# EAGLE design 2PCB-Part1 (EAGLE 9.6.2)
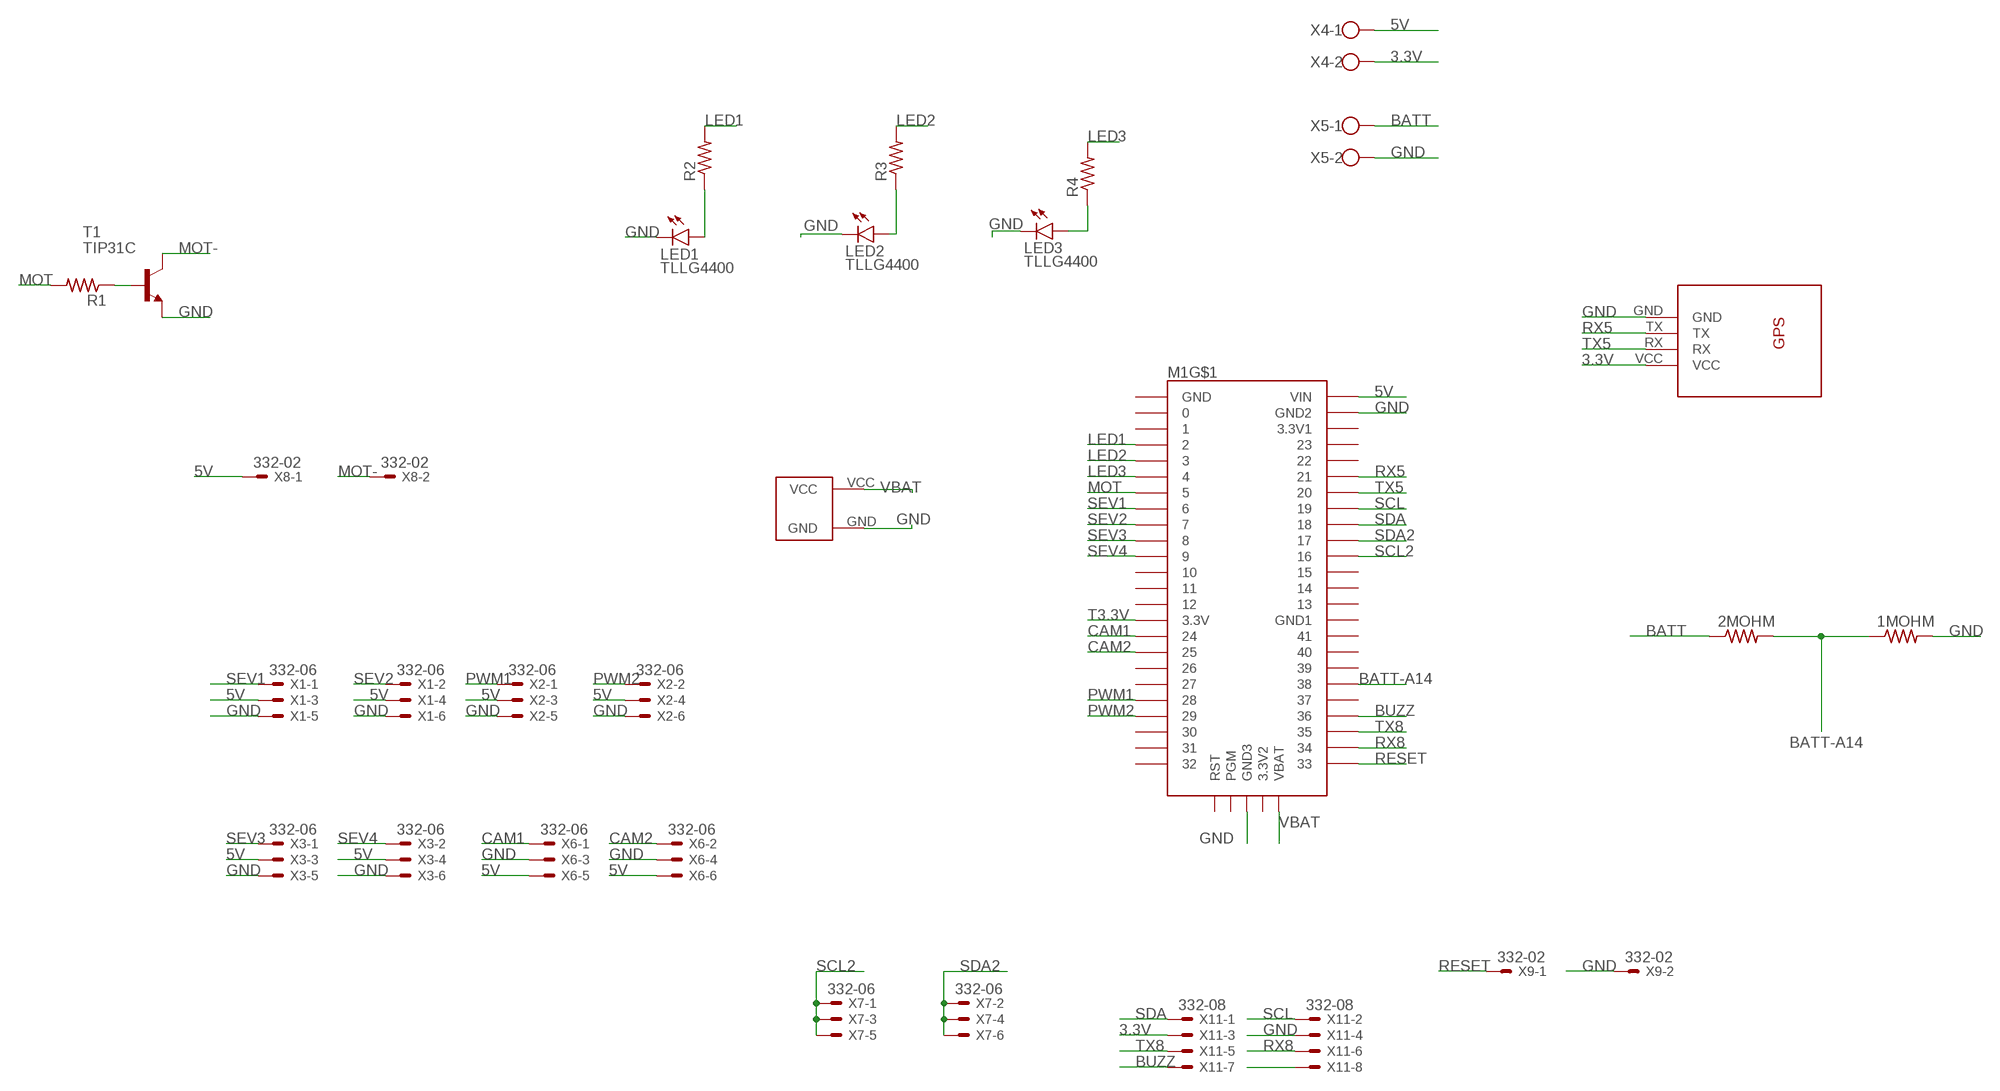
[diagram p0: schematic, sheet 1]

## Parts
1MOHM  R-US_0207/10  [0207/10]
2MOHM  R-US_0207/10  [0207/10]
LED1  TLLG4400  [LED3MM]
LED2  TLLG4400  [LED3MM]
LED3  TLLG4400  [LED3MM]
M1  TEENSY4.1  [TEENSY4.1]
R1  R-US_0207/10  [0207/10]
R2  R-US_0207/10  [0207/10]
R3  R-US_0207/10  [0207/10]
R4  R-US_0207/10  [0207/10]
T1  TIP31C  [TO220]
U$1  GPS  [GPS]
U$2  CR2032  [CR2032-20MM]
X1  332-06  [332-06]
X2  332-06  [332-06]
X3  332-06  [332-06]
X4  W237-102  [W237-102]
X5  W237-102  [W237-102]
X6  332-06  [332-06]
X7  332-06  [332-06]
X8  332-02  [332-02]
X9  332-02  [332-02]
X11  332-08  [332-08]

## Nets
3.3V: U$1.VCC X4.2 X11.3
5V: M1.VIN X1.3 X1.4 X2.3 X2.4 X3.3 X3.4 X4.1 X6.5 X6.6 X8.1
BATT: 2MOHM.1 X5.1
BATT-A14: 1MOHM.1 2MOHM.2 M1.38
BUZZ: M1.36 X11.7
CAM1: M1.24 X6.1
CAM2: M1.25 X6.2
GND: 1MOHM.2 LED1.K(C) LED2.K(C) LED3.K(C) M1.AGND(GND2) M1.GND2(GND3) T1.3(E) U$1.GND U$2.GND X1.5 X1.6 X2.5 X2.6 X3.5 X3.6 X5.2 X6.3 X6.4 X9.2 X11.4
LED1: M1.2 R2.2
LED2: M1.3 R3.2
LED3: M1.4 R4.2
MOT: M1.5 R1.2
MOT-: T1.2(C) X8.2
N$1: LED1.A R2.1
N$2: LED2.A R3.1
N$3: LED3.A R4.1
N$4: R1.1 T1.1(B)
N$10: X11.8
PWM1: M1.28 X2.1
PWM2: M1.29 X2.2
RESET: M1.33 X9.1
RX5: M1.21/A7 U$1.TX
RX8: M1.34 X11.6
SCL: M1.19/A5/SCL X11.2
SCL2: M1.16/A2 X7.1 X7.3 X7.5
SDA: M1.18/A4/SDA X11.1
SDA2: M1.17/A3 X7.2 X7.4 X7.6
SEV1: M1.6 X1.1
SEV2: M1.7 X1.2
SEV3: M1.8 X3.1
SEV4: M1.9 X3.2
T3.3V: M1.3V3(3.3V)
TX5: M1.20/A6 U$1.RX
TX8: M1.35 X11.5
VBAT: M1.VBAT U$2.VCC
Unconnected: M1.0/RX M1.1/TX M1.3V3_LO(3.3V1) M1.10/CS M1.11/MOSI M1.12/MISO M1.13/SCK M1.14/A0 M1.15/A1 M1.22/A8 M1.23/A9 M1.26 M1.27 M1.30 M1.31/A12 M1.32 M1.37 M1.39 M1.40 M1.41 M1.ELED M1.ER+ M1.ER- M1.ET+(ET-) M1.ET-(ET+) M1.GND M1.GND1 M1.GND-E(EGND) M1.GND-U1(UGND1) M1.GND-U2(UGND2) M1.PROG(PGM) M1.RST M1.UD+(UDP) M1.UD-(UDM) M1.UVHST(U5V) M1.V33(3.3V2)

## Library data of the parts
1MOHM 2MOHM R1-R4 = rcl:R-US_: RESISTOR, American symbol; SPICEPREFIX: R
LED1-LED3 = led:TLLG4400: Low Current (2mA) LED 3 mm Tinted Diffused Package color GREEN Source: Data sheet <http://www.farnell.com/datasheets/391098.pdf>; MF: VISHAY SEMICONDUCTOR; OC_FARNELL: 1612435
M1 = teensy4.1.dist:TEENSY4.1
T1 = transistor:TIP31: NPN Transistor Medium Power Linear Switching Applications Source: http://onsemi.com
U$1 = GPS:GPS
U$2 = cr2032:CR2032
X1-X3 X6 X7 = 6pinConnector:332-06: 6 Pin - 2mm Dual Row Source: www.mpe-connector.de / garry_shortform_2012.pdf
X4 X5 = con-wago-500:W237-102: WAGO SCREW CLAMP; MPN: 237-102; OC_FARNELL: unknown; OC_NEWARK: 70K9898
X8 X9 = 6pinConnector:332-02: 2 Pin - 2mm Dual Row Source: www.mpe-connector.de / garry_shortform_2012.pdf
X11 = 6pinConnector:332-08: 8 Pin - 2mm Dual Row Source: www.mpe-connector.de / garry_shortform_2012.pdf

## Board
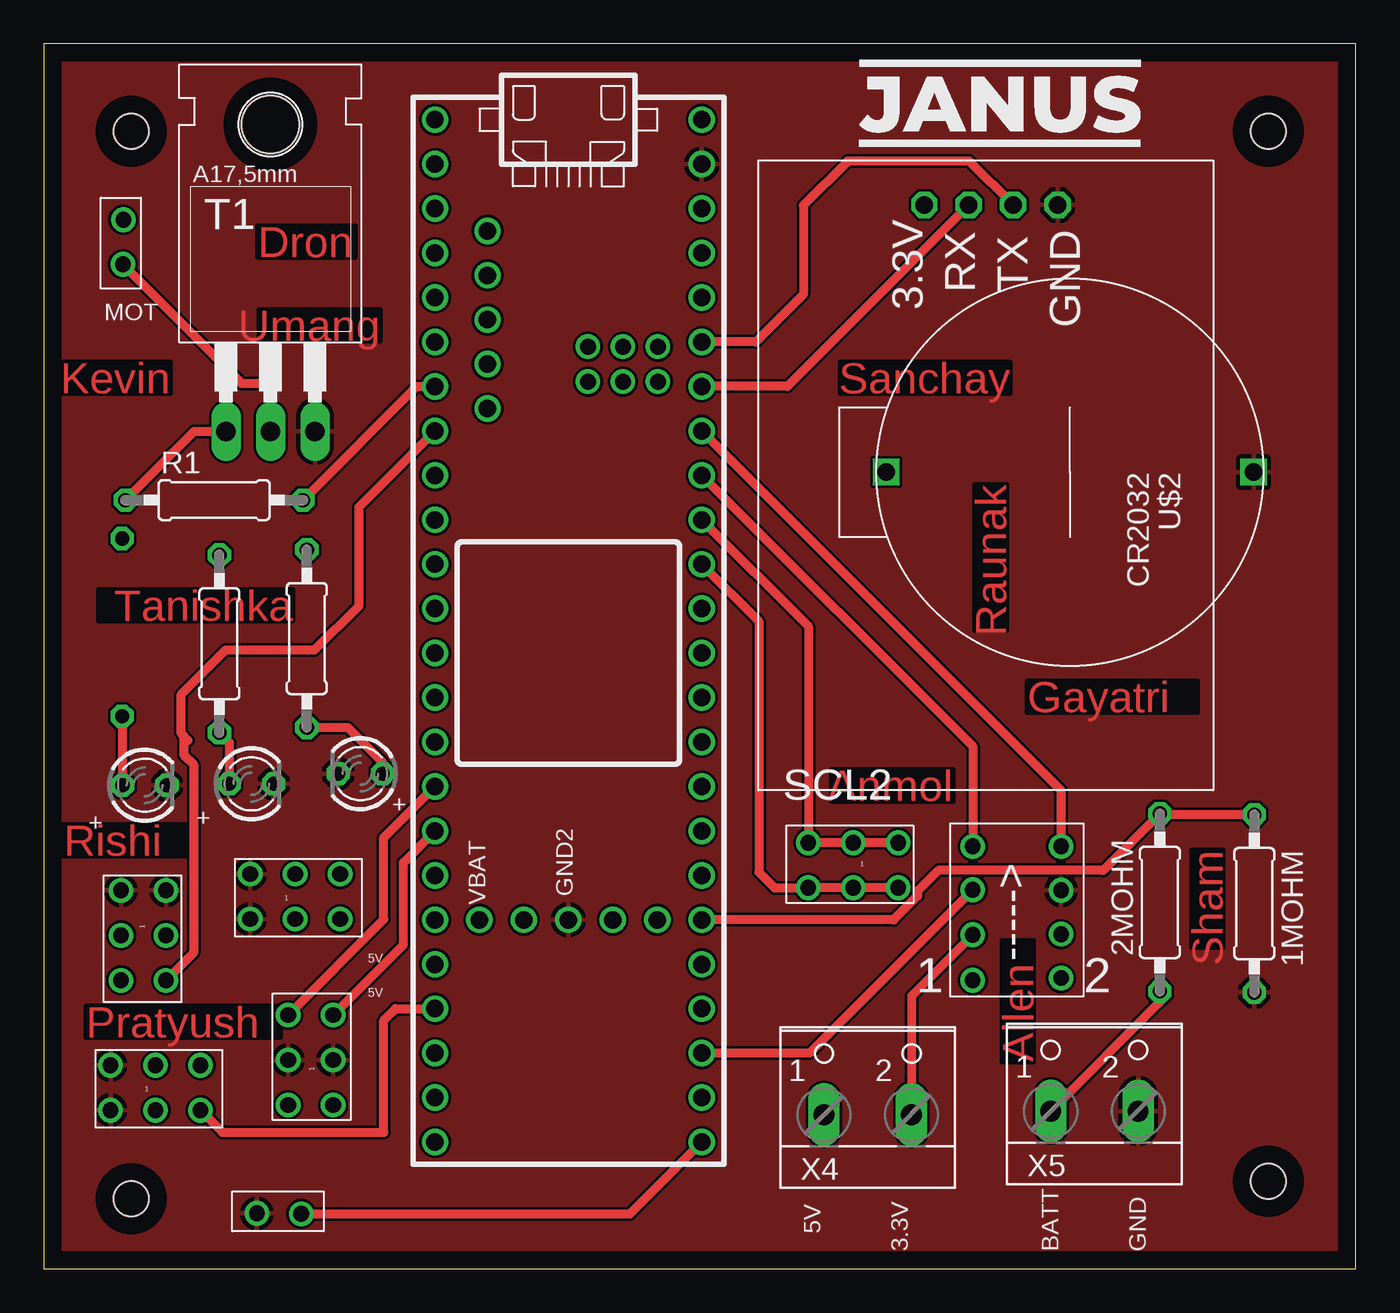
[diagram p1: board, top side]
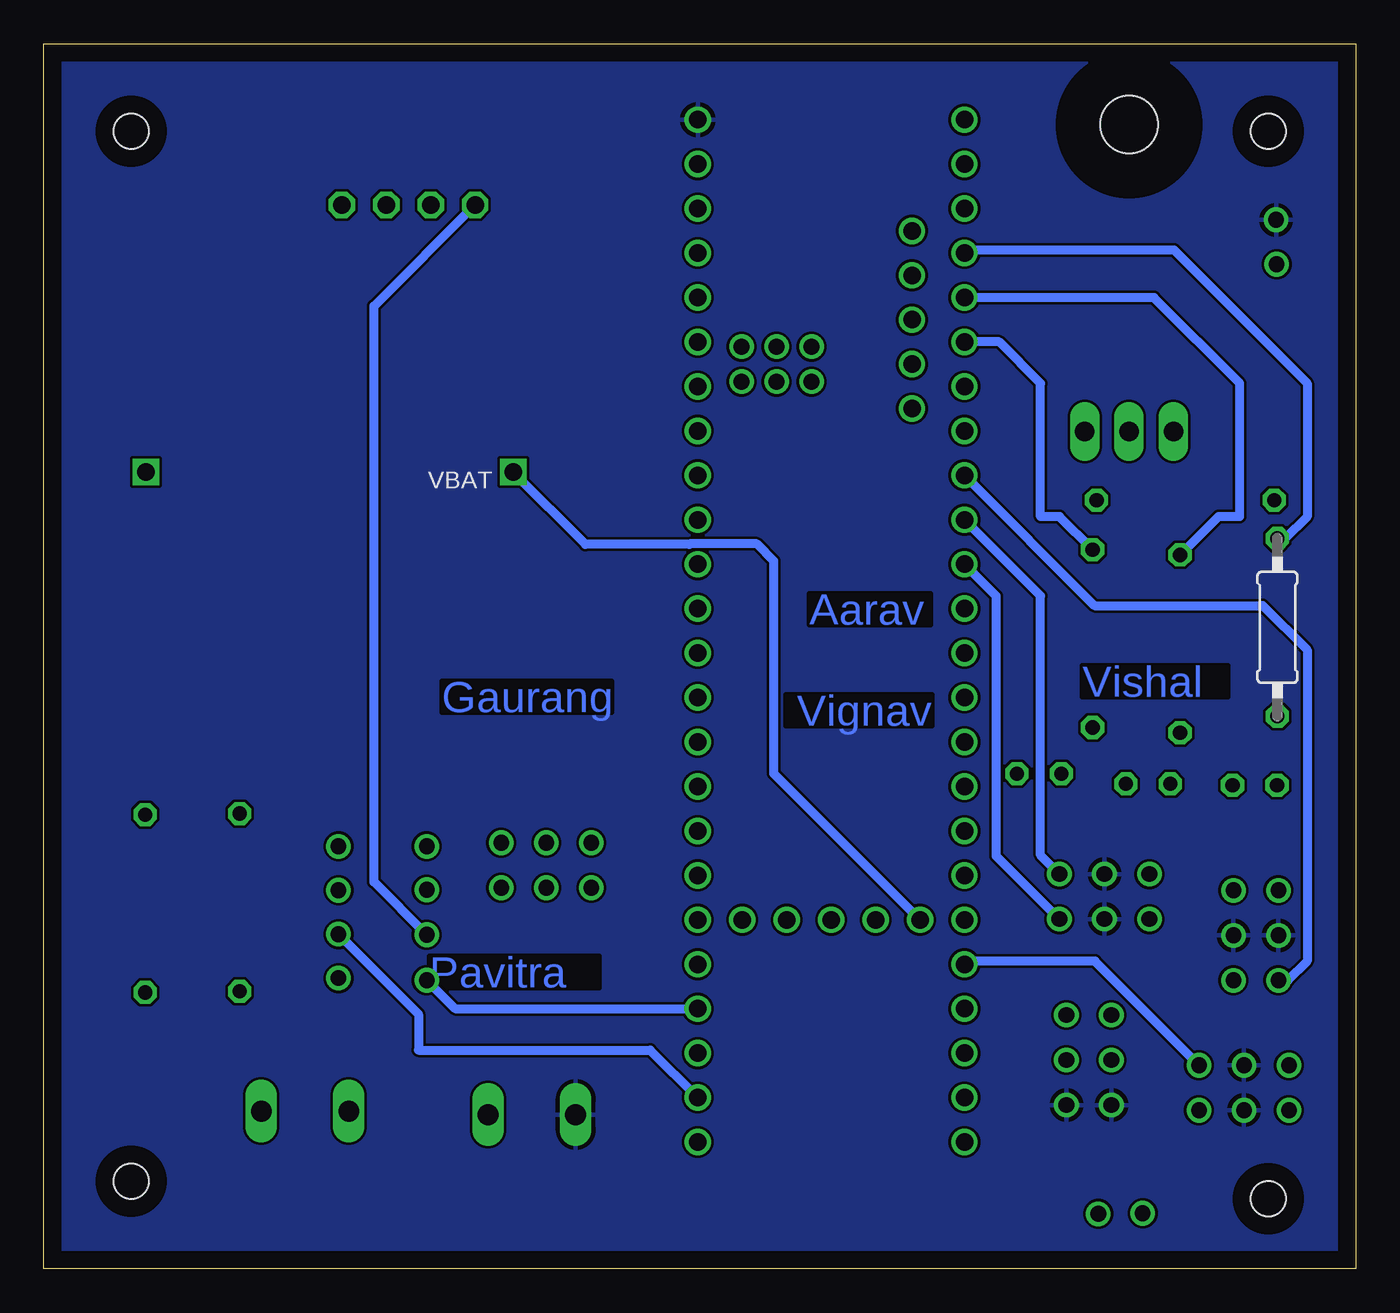
[diagram p2: board, bottom side, seen from below]

Size 75 x 70 mm. Coordinates in mm from the lower left corner, seen from the top.
Outline: 0,0 75,0 75,70 0,70 0,0
Copper layers (1*16): Top 0.035mm / dielectric 1.5mm / Bottom 0.035mm
Design rules "default": minimum track width 6mil, minimum drill 0.35mm, track to track 6mil, track to pad 6mil, pad to pad 6mil, via to via 6mil, smd to smd 6mil, copper to edge 40mil, drill to drill 6mil, minimum pad ring 10mil, minimum via ring 8mil, stop-mask expansion 4mil, vias tented up to drill 0mil, thermal gap 10mil
Holes 2 mm at 5,65 5,4 70,65 70,5

### Footprints (pad centres in the part's own frame; a part is rotated, then mirrored left to right if it is on the bottom)
0207/10 = drill 0.813 octagon: 1 -5.08,0; 2 5.08,0
LED3MM = drill 0.813 octagon: A -1.27,0; K 1.27,0
TEENSY4.1 = drill 1: 0/RX -26.67,-7.62; 1/TX -24.13,-7.62; 2 -21.59,-7.62; 3 -19.05,-7.62; 3V3 6.35,-7.62; 3V3_LO -24.13,7.62; 4 -16.51,-7.62; 5 -13.97,-7.62; 6 -11.43,-7.62; 7 -8.89,-7.62; 8 -6.35,-7.62; 9 -3.81,-7.62; 10/CS -1.27,-7.62; 11/MOSI 1.27,-7.62; 12/MISO 3.81,-7.62; 13/SCK 3.81,7.62; 14/A0 1.27,7.62; 15/A1 -1.27,7.62; 16/A2 -3.81,7.62; 17/A3 -6.35,7.62; 18/A4/SDA -8.89,7.62; 19/A5/SCL -11.43,7.62; 20/A6 -13.97,7.62; 21/A7 -16.51,7.62; 22/A8 -19.05,7.62; 23/A9 -21.59,7.62; 24 8.89,-7.62; 25 11.43,-7.62; 26 13.97,-7.62; 27 16.51,-7.62; 28 19.05,-7.62; 29 21.59,-7.62; 30 24.13,-7.62; 31/A12 26.67,-7.62; 32 29.21,-7.62; 33 29.21,7.62; 34 26.67,7.62; 35 24.13,7.62; 36 21.59,7.62; 37 19.05,7.62; 38 16.51,7.62; 39 13.97,7.62; 40 11.43,7.62; 41 8.89,7.62; AGND -26.67,7.62; GND -29.21,-7.62; GND1 6.35,7.62; GND2 16.51,0; GND-U1 -15.24,-4.62; GND-U2 -12.7,-4.62; PROG 16.51,2.54; RST 16.51,5.08; UD+ -17.78,-4.62; UD- -20.32,-4.62; UVHST -22.86,-4.62; V33 16.51,-2.54; VBAT 16.51,-5.08; VIN -29.21,7.62 | drill 0.9: ELED -16.24,3.12; ER+ -16.24,5.12; ER- -14.24,5.12; ET+ -14.24,1.12; ET- -16.24,1.12; GND-E -14.24,3.12
TO220 = drill 1.118 long: 1 -2.54,-6.35; 2 0,-6.35; 3 2.54,-6.35 | hole 3.302: 0,11.176
GPS = drill 1 octagon: GND 8.89,2.54; RX 13.97,2.54; TX 11.43,2.54; VCC 16.51,2.54
CR2032-20MM = drill 1 square: GND 0,10.5; VCC 0,-10.5
332-06 = drill 0.9 pad 1.27: 1 0.54,1.032; 2 0.54,-1.54; 3 -2.032,1.032; 4 -2.032,-1.54; 5 -4.604,1.032; 6 -4.604,-1.54
W237-102 = drill 1.194 long: 1 -2.5,-1.27; 2 2.5,-1.27
332-02 = drill 0.9 pad 1.27: 1 0,0.143; 2 2.54,0.111
332-08 = drill 0.9 pad 1.27: 1 -4.397,-3.794; 2 -4.397,1.254; 3 0.651,-3.794; 4 -1.889,1.254; 5 -1.921,-3.794; 6 0.619,1.254; 7 3.254,-3.794; 8 3.127,1.254

### Placement (x,y rotation side)
1MOHM  69.2,20.87 270 top
2MOHM  63.8,20.93 90 top
LED1  5.77,27.63 0 top
LED2  11.87,27.71 0 top
LED3  18.1,28.29 180 top
M1  29.99,36.45 270 top
R1  9.74,43.92 0 top
R2  4.48,36.65 90 bottom
R3  10.04,35.71 90 top
R4  15.04,36.01 90 top
T1  12.96,54.2 0 top
U$1  66.85,63.33 180 top
U$2  58.66,45.52 270 top
X1  5.96,17.02 270 top
X2  8.42,10.6 0 top
X3  16.4,21.52 0 top
X4  47.1,10.08 0 top
X5  60.06,10.28 0 top
X6  15,13.96 90 top
X7  44.24,22.8 180 top
X8  4.41,59.94 270 top
X9  14.72,3.28 180 top
X11  56.9,19.74 270 top

### Tracks (layer width: path | path; a pad name or v marks a point on that pad's centre or on a via)
3.3V
  Top 0.5: X11.3 49.6,15.58 X4.2
  Bottom 0.5: X11.3 56.12,22.1 56.12,55.01 U$1.VCC
5V
  pour Bottom: -13.54,78.46 90.54,78.46 96.54,72.46 96.54,-10 -22.16,-10 -22.16,69.84
BATT
  Top 0.5: X5.1 63.8,15.25 2MOHM.1
BATT-A14
  Top 0.5: 1MOHM.1 63.86,25.95 2MOHM.2 60.56,22.77 51.15,22.77 49.95,21.57 49.95,21.31 48.58,19.94 M1.38
BUZZ
  Bottom 0.5: X11.7 51.48,14.86 M1.36
CAM1
  Top 0.5: X6.1 19.44,19.97 19.44,24.63 M1.24
CAM2
  Top 0.5: X6.2 20.56,18.52 20.56,23.21 M1.25
GND
  Bottom 0.5: LED1.K 7.01,27.6
  pour Top: -11,76 87,76 88,75 88,-5.88 -15.44,-5.88 -15.44,71.56
LED1
  Bottom 0.5: M1.2 22.19,58.22 10.4,58.22 2.78,50.6 2.78,42.98 4.03,41.73 R2.2
LED2
  Bottom 0.5: R3.2 7.83,43 6.64,43 6.64,50.6 11.54,55.5 M1.3
LED3
  Bottom 0.5: R4.2 16.93,42.98 18.02,42.98 18.02,50.6 20.38,52.96 M1.4
MOT
  Top 0.5: R1.2 21.32,50.42 M1.5
MOT-
  Top 0.5: X8.2 11.32,50.6 12.94,50.6 12.96,50.58 T1.2
N$1
  Top 0.5: R2.1 4.48,27.65 LED1.A
N$2
  Top 0.5: R3.1 10.6,30.07 LED2.A
N$3
  Top 0.5: R4.1 17.37,30.93 19.37,28.93 LED3.A
N$4
  Top 0.5: R1.1 8.59,47.85 T1.1
PWM1
  Bottom 0.5: X2.1 14.91,17.58 22.19,17.58 M1.28
PWM2
  Top 0.5: X2.2 10.22,7.8 19.44,7.8 19.44,14.2 20.1,14.86 M1.29
RESET
  Top 0.5: X9.1 33.51,3.14 M1.33
RX5
  Top 0.5: U$1.TX 52.91,63.3 45.96,63.3 43.42,60.76 43.42,55.68 40.7,52.96 M1.21/A7
RX8
  Bottom 0.5: X11.6 53.58,14.55 53.58,12.5 40.33,12.5 M1.34
SCL
  Top 0.5: M1.19/A5/SCL 58.15,27.34 X11.2
SCL2
  Top 0.5: X7.5 X7.3 X7.1 41.77,21.77 40.88,22.66 40.88,36.99 M1.16/A2
SDA
  Top 0.5: M1.18/A4/SDA 53.11,29.84 X11.1
SDA2
  Top 0.5: X7.6 X7.4 X7.2 43.7,36.71 M1.17/A3
SEV1
  Top 0.5: 8.01,30.43 7.86,30.58 7.86,32.82 10.4,35.36 15.48,35.36 18.02,37.9 18.02,43.53 M1.6 | 8.24,30.2 8.01,30.43 | 8.24,17.73 X1.1 8.56,18.05 8.56,28.82 8.01,29.37 8.01,30.43
SEV2
  Bottom 0.5: M1.7 14.93,37.9 5.32,37.9 2.78,35.36 2.78,17.58 3.88,16.48 X1.2
SEV3
  Bottom 0.5: X3.1 18.02,23.63 18.02,38.45 M1.8
SEV4
  Bottom 0.5: M1.9 20.56,38.45 20.56,23.6 X3.2
TX5
  Top 0.5: U$1.RX 42.51,50.42 M1.20/A6
TX8
  Top 0.5: X11.5 43.77,12.32 M1.35
VBAT
  Bottom 0.5: M1.VBAT 33.26,28.29 33.26,40.44 34.24,41.42 38.09,41.42 38.11,41.4 44.04,41.4 U$2.VCC

### Text on the board
Top: Dron | Umang | Kevin | Sanchay | Raunak | Tanishka | Gayatri | Anmol | Rishi | Sham | Pratyush | Allen
Bottom: Aarav | Vishal | Vignav | Gaurang | Pavitra
tPlace: RX | TX | 3.3V | GND | SCL2 | + | + | + | GND2 | VBAT | 5V | 5V | 1 | 2 | 5V | 3.3V | BATT | GND
bPlace: VBAT
tNames: MOT | ----->